# Altium schematic sheet phy0.SchDoc: SFP+ PHY 0
size A3; Date: DO NOT USE, RATHER USE PROJ OPTIONS; DrawnBy: DO NOT USE, RATHER USE PROJ OPTIONS; Engineer: DO NOT USE, RATHER USE PROJ OPTIONS; Organization: DO NOT USE, RATHER USE PROJ OPTIONS; DocumentNumber: DO NOT USE, RATHER USE PROJ OPTIONS; Revision: DO NOT USE, RATHER USE PROJ OPTIONS; SheetNumber: 2; SheetTotal: 4; SCH_Sheet_Filename: phy0.SchDoc; CurrentTime: DO NOT USE, RATHER USE PROJ OPTIONS; Time: DO NOT USE, RATHER USE PROJ OPTIONS; DocumentFullPathAndName: DO NOT USE, RATHER USE PROJ OPTIONS; DocumentName: DO NOT USE, RATHER USE PROJ OPTIONS; ModifiedDate: DO NOT USE, RATHER USE PROJ OPTIONS; ImagePath: DO NOT USE, RATHER USE PROJ OPTIONS
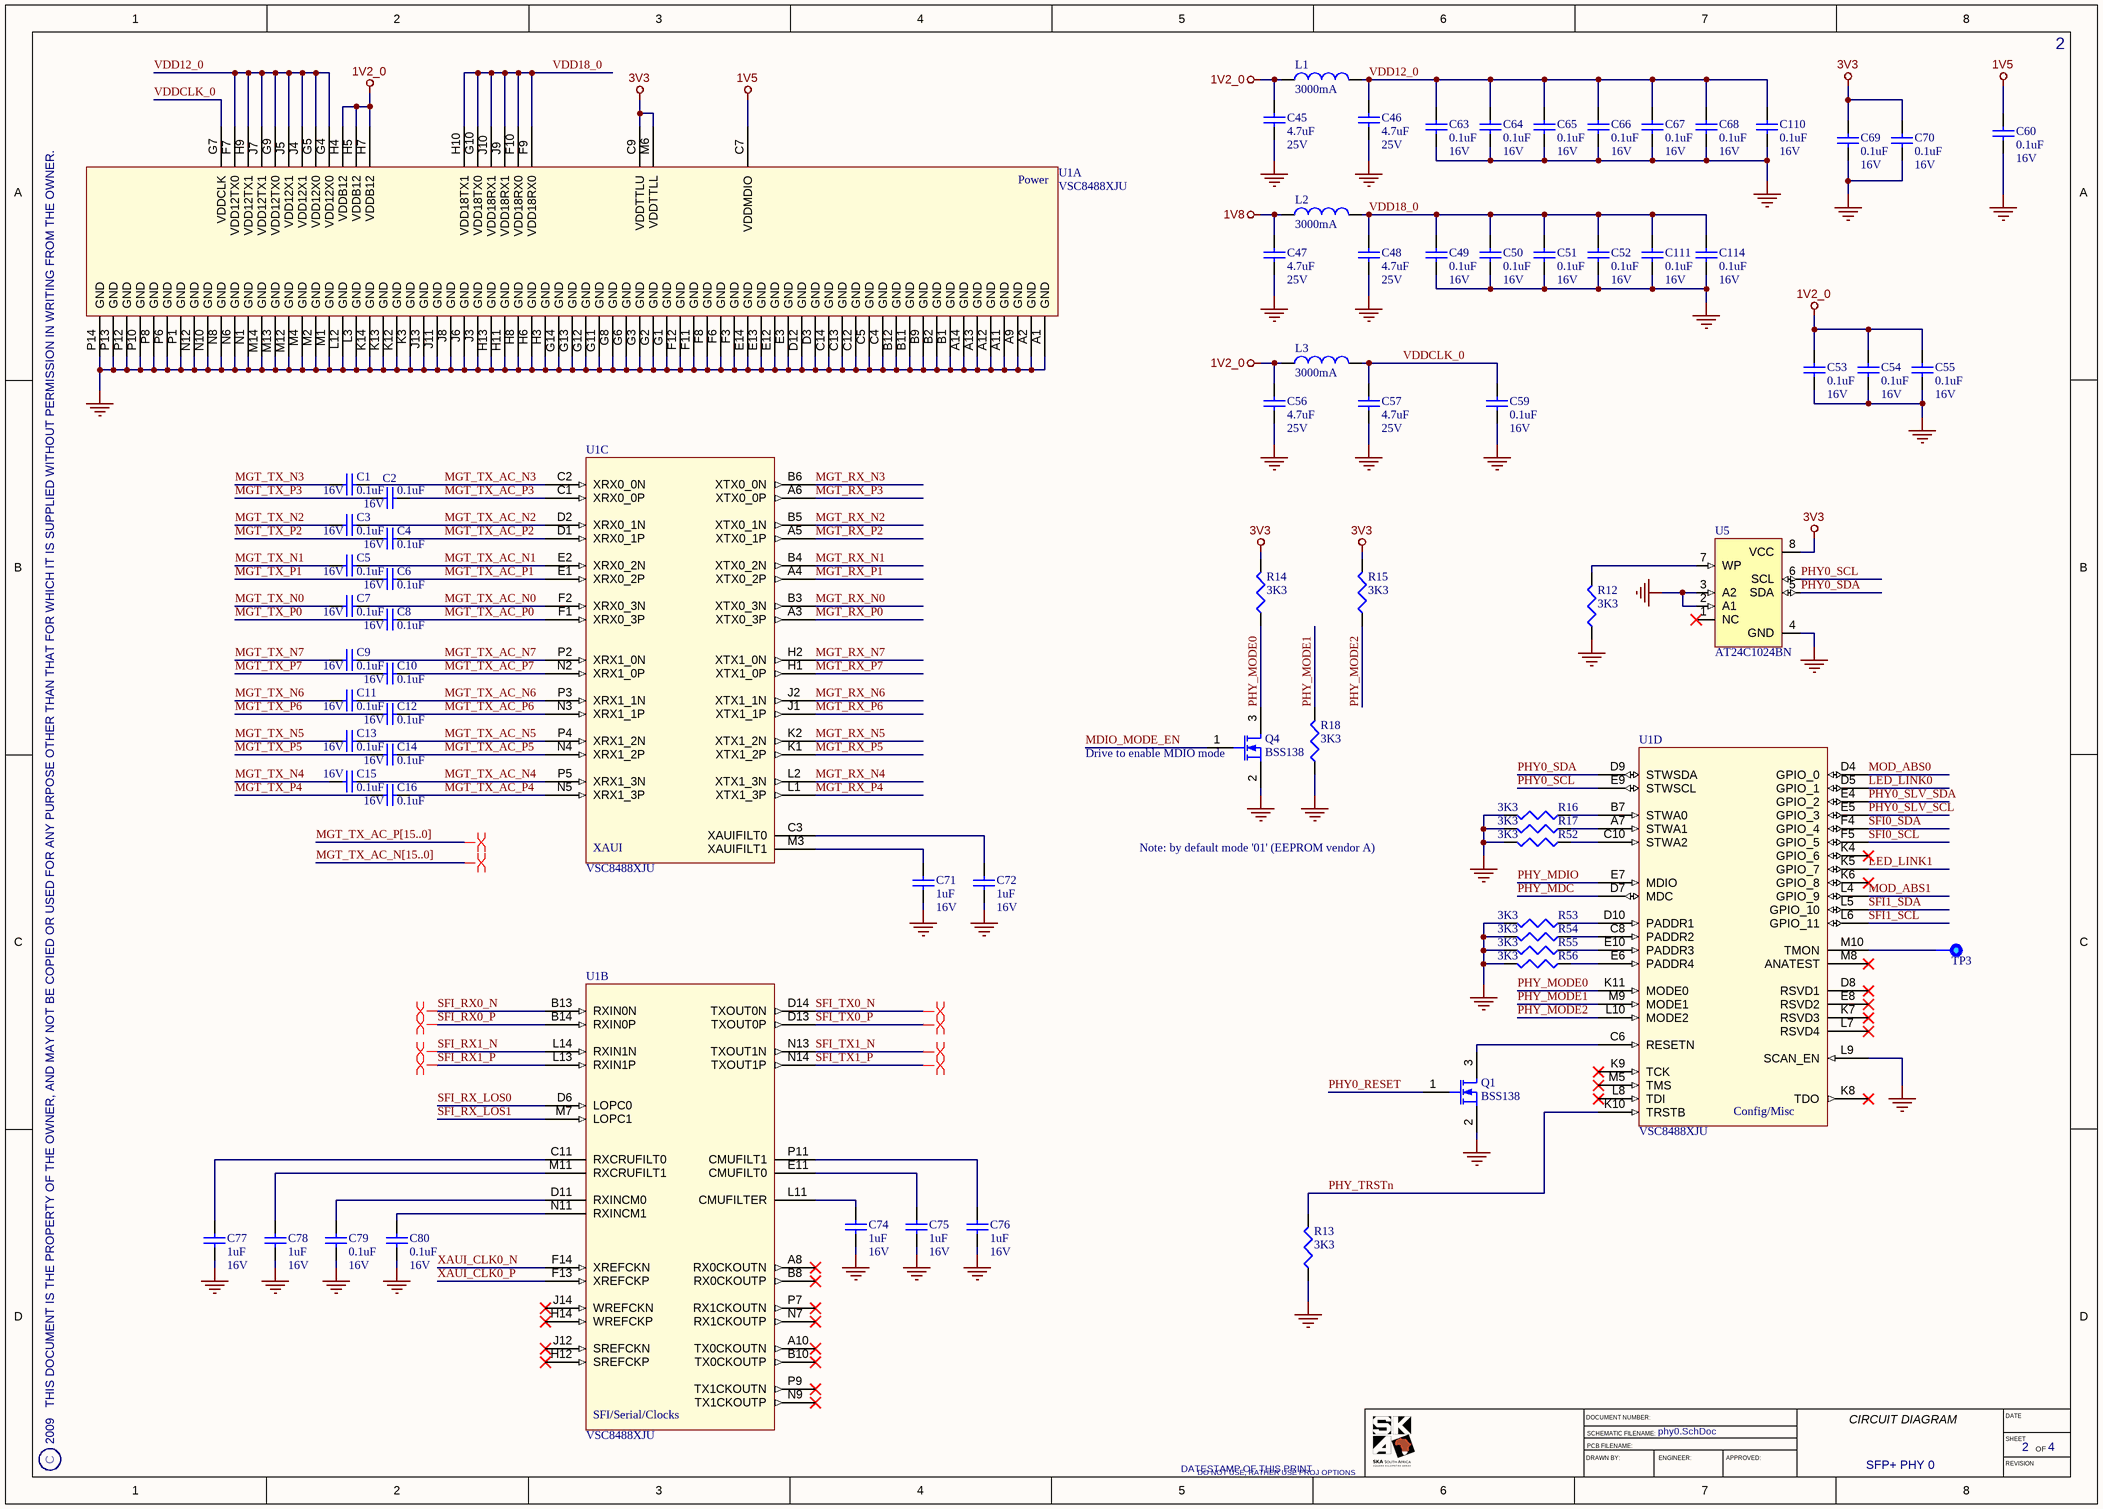
[diagram p0: phy0.SchDoc]

## Parts
C1  Rating: 16V  [CAPC1005X60L]  (hidden comment: 0.1uF)
C2  Rating: 16V  [CAPC1005X60L]  (hidden comment: 0.1uF)
C3  Rating: 16V  [CAPC1005X60L]  (hidden comment: 0.1uF)
C4  Rating: 16V  [CAPC1005X60L]  (hidden comment: 0.1uF)
C5  Rating: 16V  [CAPC1005X60L]  (hidden comment: 0.1uF)
C6  Rating: 16V  [CAPC1005X60L]  (hidden comment: 0.1uF)
C7  Rating: 16V  [CAPC1005X60L]  (hidden comment: 0.1uF)
C8  Rating: 16V  [CAPC1005X60L]  (hidden comment: 0.1uF)
C9  Rating: 16V  [CAPC1005X60L]  (hidden comment: 0.1uF)
C10  Rating: 16V  [CAPC1005X60L]  (hidden comment: 0.1uF)
C11  Rating: 16V  [CAPC1005X60L]  (hidden comment: 0.1uF)
C12  Rating: 16V  [CAPC1005X60L]  (hidden comment: 0.1uF)
C13  Rating: 16V  [CAPC1005X60L]  (hidden comment: 0.1uF)
C14  Rating: 16V  [CAPC1005X60L]  (hidden comment: 0.1uF)
C15  Rating: 16V  [CAPC1005X60L]  (hidden comment: 0.1uF)
C16  Rating: 16V  [CAPC1005X60L]  (hidden comment: 0.1uF)
C45  Rating: 25V  [CAPC2012X127L]  (hidden comment: 4.7uF)
C46  Rating: 25V  [CAPC2012X127L]  (hidden comment: 4.7uF)
C47  Rating: 25V  [CAPC2012X127L]  (hidden comment: 4.7uF)
C48  Rating: 25V  [CAPC2012X127L]  (hidden comment: 4.7uF)
C49  Rating: 16V  [CAPC1005X60L]  (hidden comment: 0.1uF)
C50  Rating: 16V  [CAPC1005X60L]  (hidden comment: 0.1uF)
C51  Rating: 16V  [CAPC1005X60L]  (hidden comment: 0.1uF)
C52  Rating: 16V  [CAPC1005X60L]  (hidden comment: 0.1uF)
C53  Rating: 16V  [CAPC1005X60L]  (hidden comment: 0.1uF)
C54  Rating: 16V  [CAPC1005X60L]  (hidden comment: 0.1uF)
C55  Rating: 16V  [CAPC1005X60L]  (hidden comment: 0.1uF)
C56  Rating: 25V  [CAPC2012X127L]  (hidden comment: 4.7uF)
C57  Rating: 25V  [CAPC2012X127L]  (hidden comment: 4.7uF)
C59  Rating: 16V  [CAPC1005X60L]  (hidden comment: 0.1uF)
C60  Rating: 16V  [CAPC1005X60L]  (hidden comment: 0.1uF)
C63  Rating: 16V  [CAPC1005X60L]  (hidden comment: 0.1uF)
C64  Rating: 16V  [CAPC1005X60L]  (hidden comment: 0.1uF)
C65  Rating: 16V  [CAPC1005X60L]  (hidden comment: 0.1uF)
C66  Rating: 16V  [CAPC1005X60L]  (hidden comment: 0.1uF)
C67  Rating: 16V  [CAPC1005X60L]  (hidden comment: 0.1uF)
C68  Rating: 16V  [CAPC1005X60L]  (hidden comment: 0.1uF)
C69  Rating: 16V  [CAPC1005X60L]  (hidden comment: 0.1uF)
C70  Rating: 16V  [CAPC1005X60L]  (hidden comment: 0.1uF)
C71  Rating: 16V  [CAPC2012X127L]  (hidden comment: 1uF)
C72  Rating: 16V  [CAPC2012X127L]  (hidden comment: 1uF)
C74  Rating: 16V  [CAPC2012X127L]  (hidden comment: 1uF)
C75  Rating: 16V  [CAPC2012X127L]  (hidden comment: 1uF)
C76  Rating: 16V  [CAPC2012X127L]  (hidden comment: 1uF)
C77  Rating: 16V  [CAPC2012X127L]  (hidden comment: 1uF)
C78  Rating: 16V  [CAPC2012X127L]  (hidden comment: 1uF)
C79  Rating: 16V  [CAPC1005X60L]  (hidden comment: 0.1uF)
C80  Rating: 16V  [CAPC1005X60L]  (hidden comment: 0.1uF)
C110  Rating: 16V  [CAPC1005X60L]  (hidden comment: 0.1uF)
C111  Rating: 16V  [CAPC1005X60L]  (hidden comment: 0.1uF)
C114  Rating: 16V  [CAPC1005X60L]  (hidden comment: 0.1uF)
L1  Rating: 3000mA  [INDC3216X130L]  (hidden comment: 120R)
L2  Rating: 3000mA  [INDC3216X130L]  (hidden comment: 120R)
L3  Rating: 3000mA  [INDC3216X130L]  (hidden comment: 120R)
Q1  BSS138  [SOT95P245X110-3N]
Q4  BSS138  [SOT95P245X110-3N]
R12  3K3  [RESC1005X40L]
R13  3K3  [RESC1005X40L]
R14  3K3  [RESC1005X40L]
R15  3K3  [RESC1005X40L]
R16  3K3  [RESC1005X40L]
R17  3K3  [RESC1005X40L]
R18  3K3  [RESC1005X40L]
R52  3K3  [RESC1005X40L]
R53  3K3  [RESC1005X40L]
R54  3K3  [RESC1005X40L]
R55  3K3  [RESC1005X40L]
R56  3K3  [RESC1005X40L]
TP3  Testpoint  [TP100]  (value not drawn)  (no BOM)
U1  VSC8488XJU  [BGA196C100P14X14_1500x1500x140]  (parts A,B,C,D of 4)
U5  AT24C1024BN  [SOIC150-8_N]

## Nets
1V2_0: C45.2 C53.2 C54.2 C55.2 C56.2 L1.1 L3.1 U1.H4(VDDB12) U1.H5(VDDB12) U1.H7(VDDB12)
1V5: C60.2 U1.C7(VDDMDIO)
1V8: C47.2 L2.1
3V3: C69.2 C70.2 R14.2 R15.2 U1.C9(VDDTTLU) U1.M6(VDDTTLL) U5.8(VCC)
GND: C45.1 C46.1 C47.1 C48.1 C49.1 C50.1 C51.1 C52.1 C53.1 C54.1 C55.1 C56.1 C57.1 C59.1 C60.1 C63.1 C64.1 C65.1 C66.1 C67.1 C68.1 C69.1 C70.1 C71.2 C72.2 C74.2 C75.2 C76.2 C77.2 C78.2 C79.1 C80.1 C110.1 C111.1 C114.1 Q1.2(S) Q4.2(S) R12.1 R13.1 R16.2 R17.2 R18.1 R52.2 R53.2 R54.2 R55.2 R56.2 U1.A1(GND) U1.A2(GND) U1.A9(GND) U1.A11(GND) U1.A12(GND) U1.A13(GND) U1.A14(GND) U1.B1(GND) U1.B2(GND) U1.B9(GND) U1.B11(GND) U1.B12(GND) U1.C4(GND) U1.C5(GND) U1.C12(GND) U1.C13(GND) U1.C14(GND) U1.D3(GND) U1.D12(GND) U1.E3(GND) U1.E12(GND) U1.E13(GND) U1.E14(GND) U1.F3(GND) U1.F6(GND) U1.F8(GND) U1.F11(GND) U1.F12(GND) U1.G1(GND) U1.G2(GND) U1.G3(GND) U1.G6(GND) U1.G8(GND) U1.G11(GND) U1.G12(GND) U1.G13(GND) U1.G14(GND) U1.H3(GND) U1.H6(GND) U1.H8(GND) U1.H11(GND) U1.H13(GND) U1.J3(GND) U1.J6(GND) U1.J8(GND) U1.J11(GND) U1.J13(GND) U1.K3(GND) U1.K12(GND) U1.K13(GND) U1.K14(GND) U1.L3(GND) U1.L9(SCAN_EN) U1.L12(GND) U1.M1(GND) U1.M2(GND) U1.M4(GND) U1.M12(GND) U1.M13(GND) U1.M14(GND) U1.N1(GND) U1.N6(GND) U1.N8(GND) U1.N10(GND) U1.N12(GND) U1.P1(GND) U1.P6(GND) U1.P8(GND) U1.P10(GND) U1.P12(GND) U1.P13(GND) U1.P14(GND) U5.2(A1) U5.3(A2) U5.4(GND)
LED_LINK0: U1.D5(GPIO_1)
LED_LINK1: U1.K5(GPIO_7)
MDIO_MODE_EN: Q4.1(G)
MGT_RX_N0: U1.B3(XTX0_3N)
MGT_RX_N1: U1.B4(XTX0_2N)
MGT_RX_N2: U1.B5(XTX0_1N)
MGT_RX_N3: U1.B6(XTX0_0N)
MGT_RX_N4: U1.L2(XTX1_3N)
MGT_RX_N5: U1.K2(XTX1_2N)
MGT_RX_N6: U1.J2(XTX1_1N)
MGT_RX_N7: U1.H2(XTX1_0N)
MGT_RX_P0: U1.A3(XTX0_3P)
MGT_RX_P1: U1.A4(XTX0_2P)
MGT_RX_P2: U1.A5(XTX0_1P)
MGT_RX_P3: U1.A6(XTX0_0P)
MGT_RX_P4: U1.L1(XTX1_3P)
MGT_RX_P5: U1.K1(XTX1_2P)
MGT_RX_P6: U1.J1(XTX1_1P)
MGT_RX_P7: U1.H1(XTX1_0P)
MGT_TX_AC_N0: C7.1 U1.F2(XRX0_3N)
MGT_TX_AC_N1: C5.1 U1.E2(XRX0_2N)
MGT_TX_AC_N2: C3.1 U1.D2(XRX0_1N)
MGT_TX_AC_N3: C1.1 U1.C2(XRX0_0N)
MGT_TX_AC_N4: C15.1 U1.P5(XRX1_3N)
MGT_TX_AC_N5: C13.1 U1.P4(XRX1_2N)
MGT_TX_AC_N6: C11.1 U1.P3(XRX1_1N)
MGT_TX_AC_N7: C9.1 U1.P2(XRX1_0N)
MGT_TX_AC_P0: C8.1 U1.F1(XRX0_3P)
MGT_TX_AC_P1: C6.1 U1.E1(XRX0_2P)
MGT_TX_AC_P2: C4.1 U1.D1(XRX0_1P)
MGT_TX_AC_P3: C2.1 U1.C1(XRX0_0P)
MGT_TX_AC_P4: C16.1 U1.N5(XRX1_3P)
MGT_TX_AC_P5: C14.1 U1.N4(XRX1_2P)
MGT_TX_AC_P6: C12.1 U1.N3(XRX1_1P)
MGT_TX_AC_P7: C10.1 U1.N2(XRX1_0P)
MGT_TX_N0: C7.2
MGT_TX_N1: C5.2
MGT_TX_N2: C3.2
MGT_TX_N3: C1.2
MGT_TX_N4: C15.2
MGT_TX_N5: C13.2
MGT_TX_N6: C11.2
MGT_TX_N7: C9.2
MGT_TX_P0: C8.2
MGT_TX_P1: C6.2
MGT_TX_P2: C4.2
MGT_TX_P3: C2.2
MGT_TX_P4: C16.2
MGT_TX_P5: C14.2
MGT_TX_P6: C12.2
MGT_TX_P7: C10.2
MOD_ABS0: U1.D4(GPIO_0)
MOD_ABS1: U1.L4(GPIO_9)
PHY0_RESET: Q1.1(G)
PHY0_SCL: U1.E9(STWSCL) U5.6(SCL)
PHY0_SDA: U1.D9(STWSDA) U5.5(SDA)
PHY0_SLV_SCL: U1.E5(GPIO_3)
PHY0_SLV_SDA: U1.E4(GPIO_2)
PHY_MDC: U1.D7(MDC)
PHY_MDIO: U1.E7(MDIO)
PHY_MODE0: Q4.3(D) R14.1 U1.K11(MODE0)
PHY_MODE1: R18.2 U1.M9(MODE1)
PHY_MODE2: R15.1 U1.L10(MODE2)
PHY_TRSTn: R13.2 U1.K10(TRSTB)
SFI0_SCL: U1.F5(GPIO_5)
SFI0_SDA: U1.F4(GPIO_4)
SFI1_SCL: U1.L6(GPIO_11)
SFI1_SDA: U1.L5(GPIO_10)
SFI_RX0_N: U1.B13(RXIN0N)
SFI_RX0_P: U1.B14(RXIN0P)
SFI_RX1_N: U1.L14(RXIN1N)
SFI_RX1_P: U1.L13(RXIN1P)
SFI_RX_LOS0: U1.D6(LOPC0)
SFI_RX_LOS1: U1.M7(LOPC1)
SFI_TX0_N: U1.D14(TXOUT0N)
SFI_TX0_P: U1.D13(TXOUT0P)
SFI_TX1_N: U1.N13(TXOUT1N)
SFI_TX1_P: U1.N14(TXOUT1P)
VDD12_0: C46.2 C63.2 C64.2 C65.2 C66.2 C67.2 C68.2 C110.2 L1.2 U1.F7(VDD12TX0) U1.G4(VDD12X0) U1.G5(VDD12X0) U1.G9(VDD12TX0) U1.H9(VDD12TX1) U1.J4(VDD12X1) U1.J5(VDD12X1) U1.J7(VDD12TX1)
VDD18_0: C48.2 C49.2 C50.2 C51.2 C52.2 C111.2 C114.2 L2.2 U1.F9(VDD18RX0) U1.F10(VDD18RX0) U1.G10(VDD18TX0) U1.H10(VDD18TX1) U1.J9(VDD18RX1) U1.J10(VDD18RX1)
VDDCLK_0: C57.2 C59.2 L3.2 U1.G7(VDDCLK)
XAUI_CLK0_N: U1.F14(XREFCKN)
XAUI_CLK0_P: U1.F13(XREFCKP)
NetC71_1: C71.1 U1.M3(XAUIFILT1)
NetC72_1: C72.1 U1.C3(XAUIFILT0)
NetC74_1: C74.1 U1.L11(CMUFILTER)
NetC75_1: C75.1 U1.E11(CMUFILT0)
NetC76_1: C76.1 U1.P11(CMUFILT1)
NetC77_1: C77.1 U1.C11(RXCRUFILT0)
NetC78_1: C78.1 U1.M11(RXCRUFILT1)
NetC79_2: C79.2 U1.D11(RXINCM0)
NetC80_2: C80.2 U1.N11(RXINCM1)
NetQ1_3: Q1.3(D) U1.C6(RESETN)
NetR12_2: R12.2 U5.7(WP)
NetR16_1: R16.1 U1.B7(STWA0)
NetR17_1: R17.1 U1.A7(STWA1)
NetR52_1: R52.1 U1.C10(STWA2)
NetR53_1: R53.1 U1.D10(PADDR1)
NetR54_1: R54.1 U1.C8(PADDR2)
NetR55_1: R55.1 U1.E10(PADDR3)
NetR56_1: R56.1 U1.E6(PADDR4)
NetTP3_1: TP3.1 U1.M10(TMON)

Not connected (* = marked no-connect by the designer): U1 A8(RX0CKOUTN)* A10(TX0CKOUTN)* B8(RX0CKOUTP)* B10(TX0CKOUTP)* D8(RSVD1)* E8(RSVD2)* H12(SREFCKP)* H14(WREFCKP)* J12(SREFCKN)* J14(WREFCKN)* K4(GPIO_6)* K6(GPIO_8)* K7(RSVD3)* K8(TDO)* K9(TCK)* L7(RSVD4)* L8(TDI)* M5(TMS)* M8(ANATEST)* N7(RX1CKOUTP)* N9(TX1CKOUTP)* P7(RX1CKOUTN)* P9(TX1CKOUTN)*; U5 1(NC)*

## Buses and harness runs
bus MGT_TX_AC_N[15..0]
bus MGT_TX_AC_P[15..0]

## Layout directives
differential pair: (no net found under the mark), SFI_RX0_N, SFI_RX0_P, SFI_RX1_N, SFI_RX1_P, SFI_TX0_N, SFI_TX0_P, SFI_TX1_N, SFI_TX1_P

## Notes on the sheet
- (near Q4) Drive to enable MDIO mode
- Note: by default mode '01' (EEPROM vendor A)
- 2009   THIS DOCUMENT IS THE PROPERTY OF THE OWNER, AND MAY NOT BE COPIED OR USED FOR ANY PURPOSE OTHER THAN THAT FOR WHICH IT IS SUPPLIED WITHOUT PERMISSION IN WRITING FROM THE OWNER.
- C
- DATESTAMP OF THIS PRINT
- DRAWN BY:
- DOCUMENT NUMBER:
- SCHEMATIC FILENAME:
- PCB FILENAME:
- ENGINEER:
- APPROVED:
- CIRCUIT DIAGRAM
- DATE
- SHEET
- REVISION
- OF
- (in symbol IC-PHY-2, part A) Power
- (in symbol IC-PHY-2, part B) SFI/Serial/Clocks
- (in symbol IC-PHY-2, part C) XAUI
- (in symbol IC-PHY-2, part D) Config/Misc

## Library data of the parts
C1-C16 C49-C55 C59 C60 C63-C70 C79 C80 C110 C111 C114 = CAP-CER-1: 0.1uF, Ceramic Capacitor; Manufacturer: VENKEL; PartNum: C0402X7R160-104KN; Tolerance: 10%; Dielectric: X7R; POD number: CAP-CER-1; Value: 0.1uF; RoHS: Y; Sort Value: 0.1; Category: Capacitors; Subcategory: Ceramic
C45-C48 C56 C57 = CAP-CER-3: 4.7uF, Ceramic Capacitor; Manufacturer: MURATA; PartNum: GRM21BR61E475KA12K; Tolerance: 10%; Dielectric: X5R; POD number: CAP-CER-3; Value: 4.7uF; RoHS: Y; Sort Value: 4.7; Category: Capacitors; Subcategory: Ceramic
C71 C72 C74-C78 = CAP-CER-8: 1uF, Ceramic Capacitor; Manufacturer: MURATA; PartNum: GRM21BR61C105KA01L; Tolerance: 10%; Dielectric: X5R; POD number: CAP-CER-8; Value: 1uF; RoHS: Y; Sort Value: 100; Category: Capacitors; Subcategory: Ceramic
L1-L3 = IND-FB-1: 120 Ohm, Chip Ferrite Brad; Manufacturer: Murata; PartNum: BLM31PG121SN1; DC Res: 0.025R; Tolerance: 25%; POD number: IND-FB-1; RoHS: Y; Value: 120R; Sort Value: 120; Category: Inductors; Subcategory: FerriteBead
Q1 Q4 = TRANS-NFET-0: N-Channel Logic Level Enhancement Mode Field Effect Transistor; Manufacturer: Fairchild Semiconductor; Rating: 0.22A; POD number: TRANS-NFET-0; PartNum: BSS138; RoHS: Y; Category: TRANS; Subcategory: NFET
R12-R18 R52-R56 = RES-TF-7: 3K3, 1.1mm x 0.5mm, Thick Film Resistor; Manufacturer: ROYALOHM; PartNum: 0402WGJ0332T1E; Tolerance: 5%; Rating: 0.0625W; POD number: RES-TF-7; Value: 3K3; Sort Value: 3300; Category: Resistors; Subcategory: ThickFilm; HelpURL: http://www.royalohm.com/pdf/general.pdf
TP3 = ELMECH-TP-0: 1mm Diameter, through-hole, Circular Test-point; POD number: ELMECH-TP-0; RoHS: Y; Category: ELMECH; Subcategory: Test Points
U1 = IC-PHY-2: DualChannel WAN/LAN/Backplane XAUI to SFP+/KR Transceiver; Manufacturer: Vitesse; POD number: IC-PHY-2; PartNum: VSC8488XJU; RoHS: Y; Category: IC; Subcategory: Network PHY
U5 = IC-MEM-5: 1M, SOIC-8, Serial EEPROM; Manufacturer: Atmel; PartNum: AT24C1024BN-SH-B; POD number: IC-MEM-5; RoHS: Y; Category: IC; Subcategory: Memory